# Altium schematic sheet 11- IMU.SchDoc: IMU
size A3; Page Number: 11; Page Size: B; Page Count: 12; Board Rev: B; Project Name: CrossLink-NX Evaluation Board; RevCode: 1.0; Doc: 305-PD-19-0819; DsnPath: C:\Users\HAltinkilit\Downloads\Crosslink-NX-Design-Files\CrossLink-NX-Eval-Brd-Schematic-RevB-191122.DSN; SchematicName: SCHEMATIC1; PageName: 14 - Power Diagram; PageSize: B; TopSchematic: True
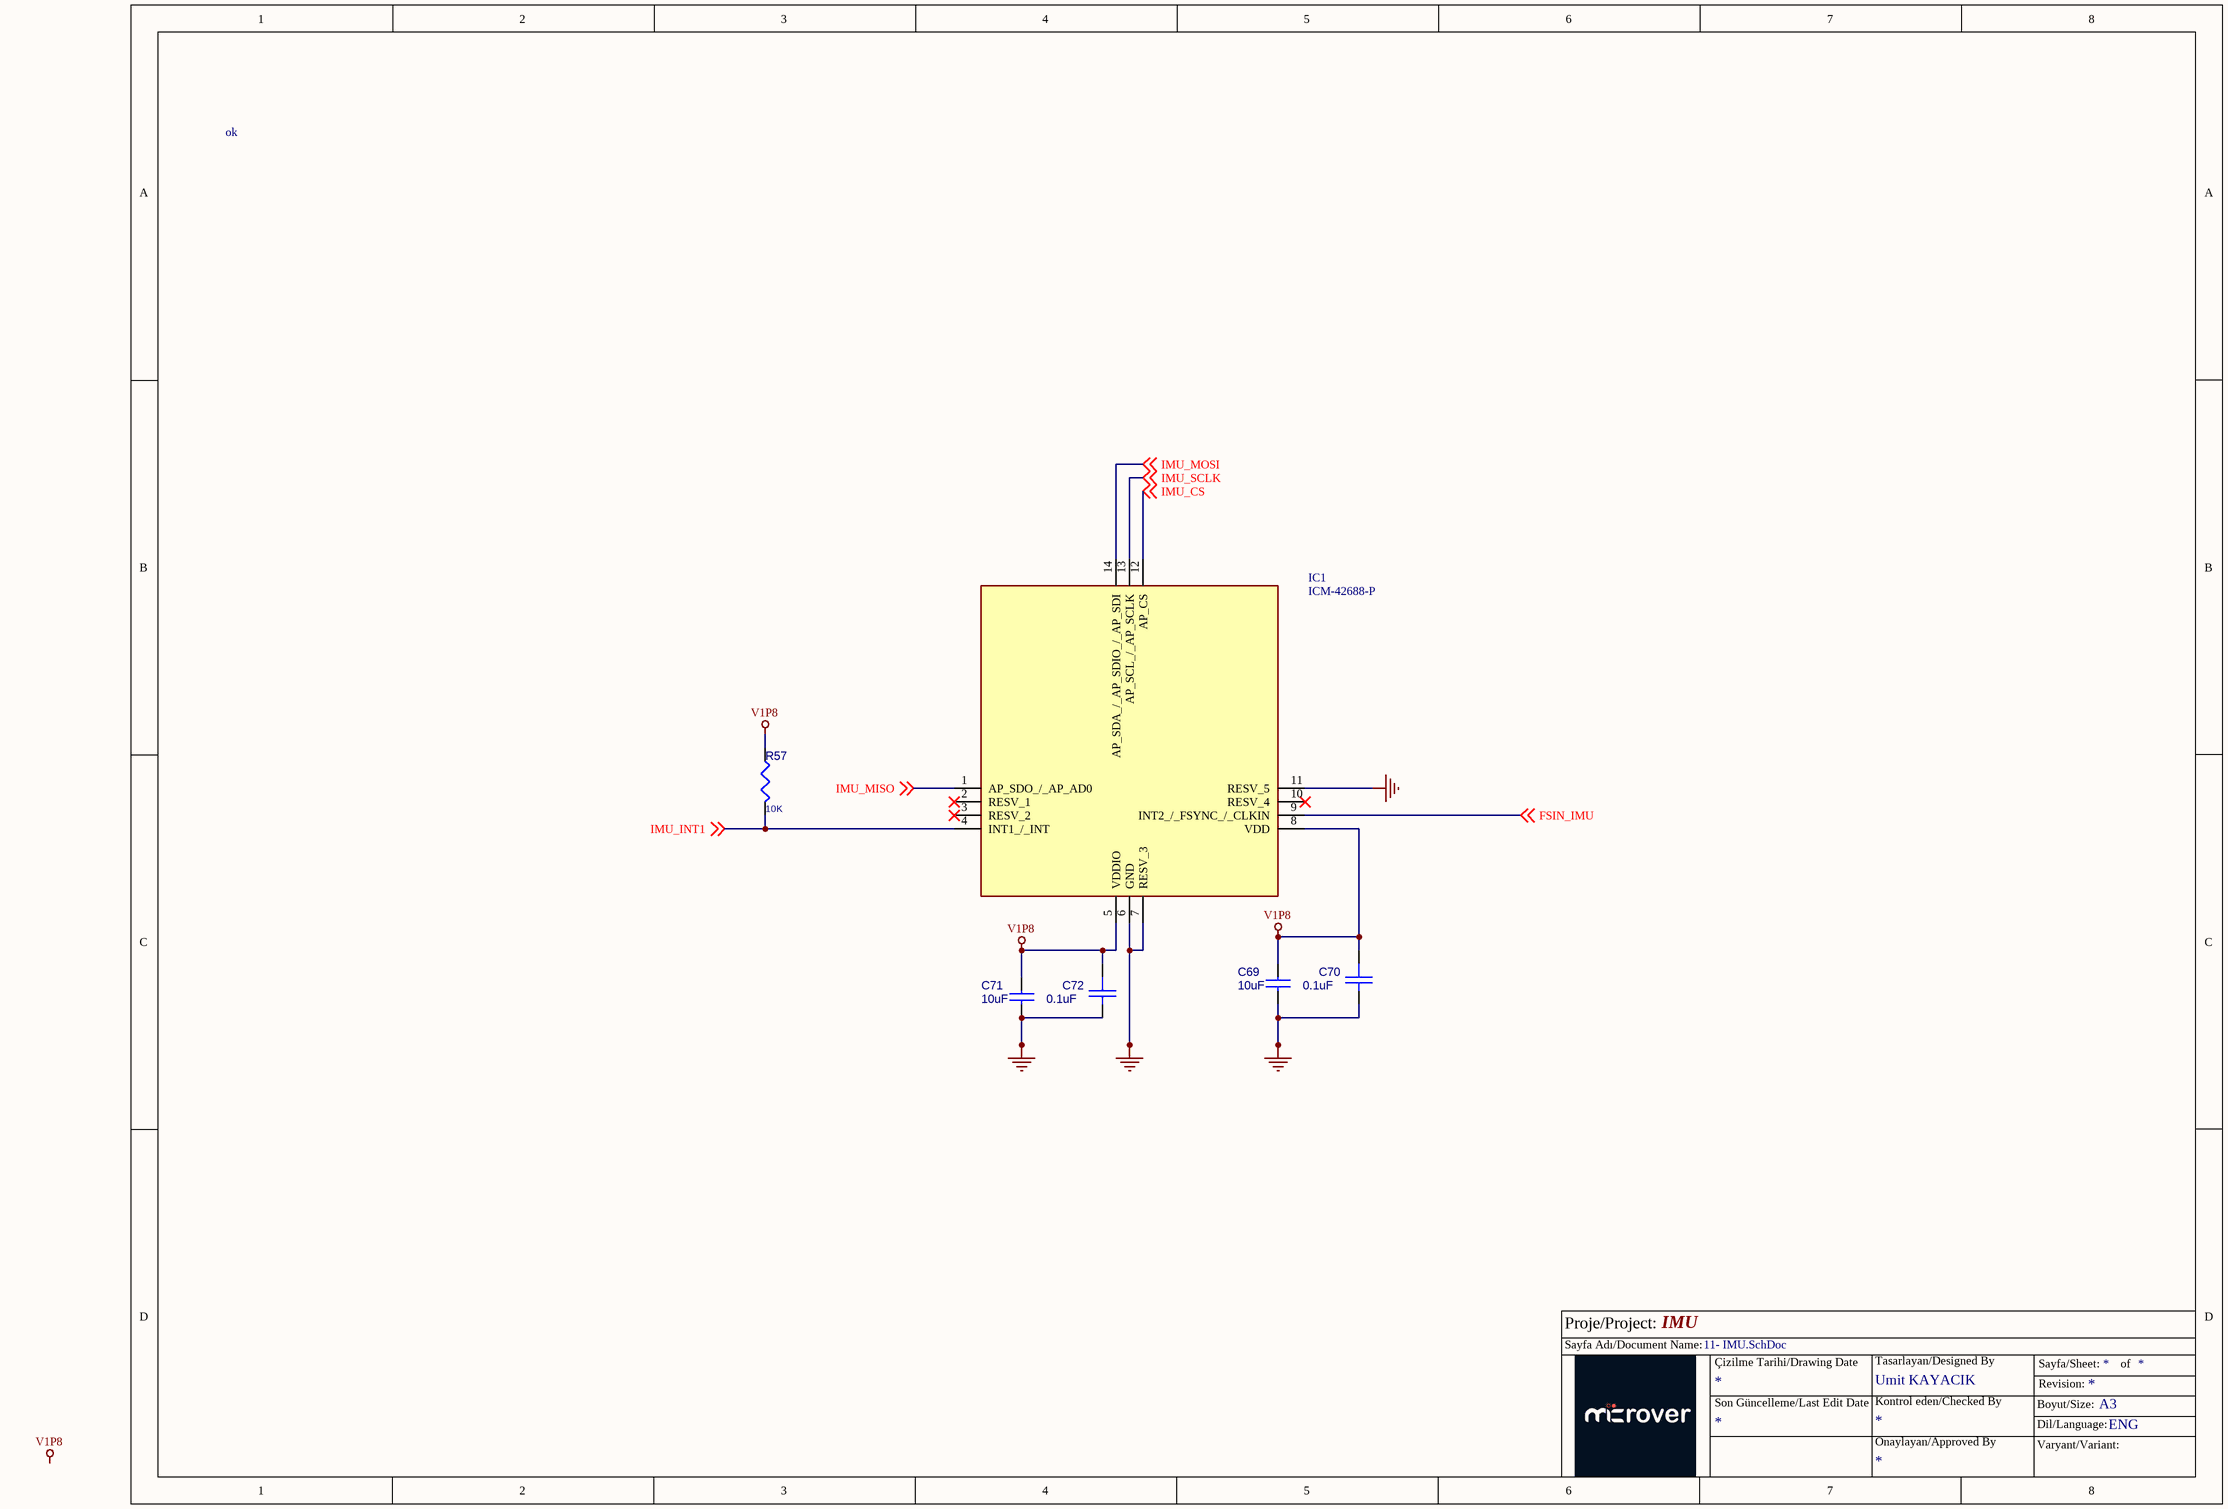
[diagram p0: 11- IMU.SchDoc]

## Parts
C69  10uF  [C0603]
C70  0.1uF  [C0201]
C71  10uF  [C0603]
C72  0.1uF  [C0201]
IC1  ICM-42688-P  [IIM42352]
R57  10K  [R0402]

## Nets
GND: C69.2 C70.2 C71.2 C72.2 IC1.6(GND) IC1.7(RESV_3) IC1.11(RESV_5)
V1P8: C69.1 C70.1 C71.1 C72.1 IC1.5(VDDIO) IC1.8(VDD) R57.1
FSIN_IMU: IC1.9(INT2_/_FSYNC_/_CLKIN) ; off-sheet FSIN_IMU
IMU_CS: IC1.12(AP_CS) ; off-sheet IMU_CS
IMU_INT1: IC1.4(INT1_/_INT) R57.2 ; off-sheet IMU_INT1
IMU_MISO: IC1.1(AP_SDO_/_AP_AD0) ; off-sheet IMU_MISO
IMU_MOSI: IC1.14(AP_SDA_/_AP_SDIO_/_AP_SDI) ; off-sheet IMU_MOSI
IMU_SCLK: IC1.13(AP_SCL_/_AP_SCLK) ; off-sheet IMU_SCLK

Not connected (* = marked no-connect by the designer): IC1 2(RESV_1)* 3(RESV_2)* 10(RESV_4)*

## Notes on the sheet
- ok
- Labels drawn without touching a wire or pin: V1P8
- Proje/Project:
- Sayfa Adı/Document Name:
- Çizilme Tarihi/Drawing Date
- Umit KAYACIK
- Tasarlayan/Designed By
- Sayfa/Sheet:
- Revision:
- of
- Son Güncelleme/Last Edit Date
- Kontrol eden/Checked By
- Onaylayan/Approved By
- Boyut/Size:
- Varyant/Variant:
- Dil/Language:
- A3
- ENG

## Library data of the parts
C69 C71 = CAP NP: CAP CER 10UF 10V 20% X6S 0603; Part Reference: C140; Man. Part #: CL10X106MP8NRNC; MFG: Samsung; Value: 10uF; Assy: -; Manufacturer: Samsung; MFG P/N: CL10X106MP8NRNC; Manufacturer Part Number: CL10X106MP8NRNC; PCB Footprint: C0603
C70 C72 = CAP_SMT_0805: CAP CER 0.1UF 25V 10% X5R 0201; Part Reference: C120; Manufacturer: Murata; Manufacturer Part Number: GRM033R61E104KE14J; Value: 0.1uF; Assy: -; PCB Footprint: C0201
IC1 = ICM-42688-P: Integrated Circuit; Manufacturer_Name: TDK; Datasheet Link: https://3cfeqx1hf82y3xcoull08ihx-wpengine.netdna-ssl.com/wp-content/uploads/2021/06/DS-000347-ICM-42688-P-v1.5.pdf; Manufacturer_Part_Number: ICM-42688-P; Mouser Part Number: 410-ICM-42688-P; Mouser Price/Stock: https://www.mouser.co.uk/ProductDetail/TDK-InvenSense/ICM-42688-P?qs=OlC7AqGiEDk8QrNAV728zw%3D%3D; Arrow Part Number: ICM-42688-P; Arrow Price/Stock: https://www.arrow.com/en/products/icm-42688-p/invensense?utm_currency=USD&region=nac
R57 = RES_10K_1W16_0402_5P: RES 10K OHM 1/10W 5% 0603; Part Reference: R10; Manufacturer Part Number: RMCF0603JT10K0; Unit Price (USD): 0.02; Total Area(sq-mm): 0.5; DIST: FLAT; MAX_TEMP: RTMAX; MFG P/N: RMCF0402JT10K0; MFG: Stackpole Electronics Inc; TC1: 0; PCB Footprint: R0603; Length(mm): 1; Width(mm): 0.5; Wattage: 1/10W; TC2: 0; Value: 10K; Manufacturer: Stackpole Electronics Inc; Digikey P/N: RMCF0603JT10K0TR-ND; Assy: -